# Altium schematic sheet STSPIN32F0A ESC1.SchDoc
size A3
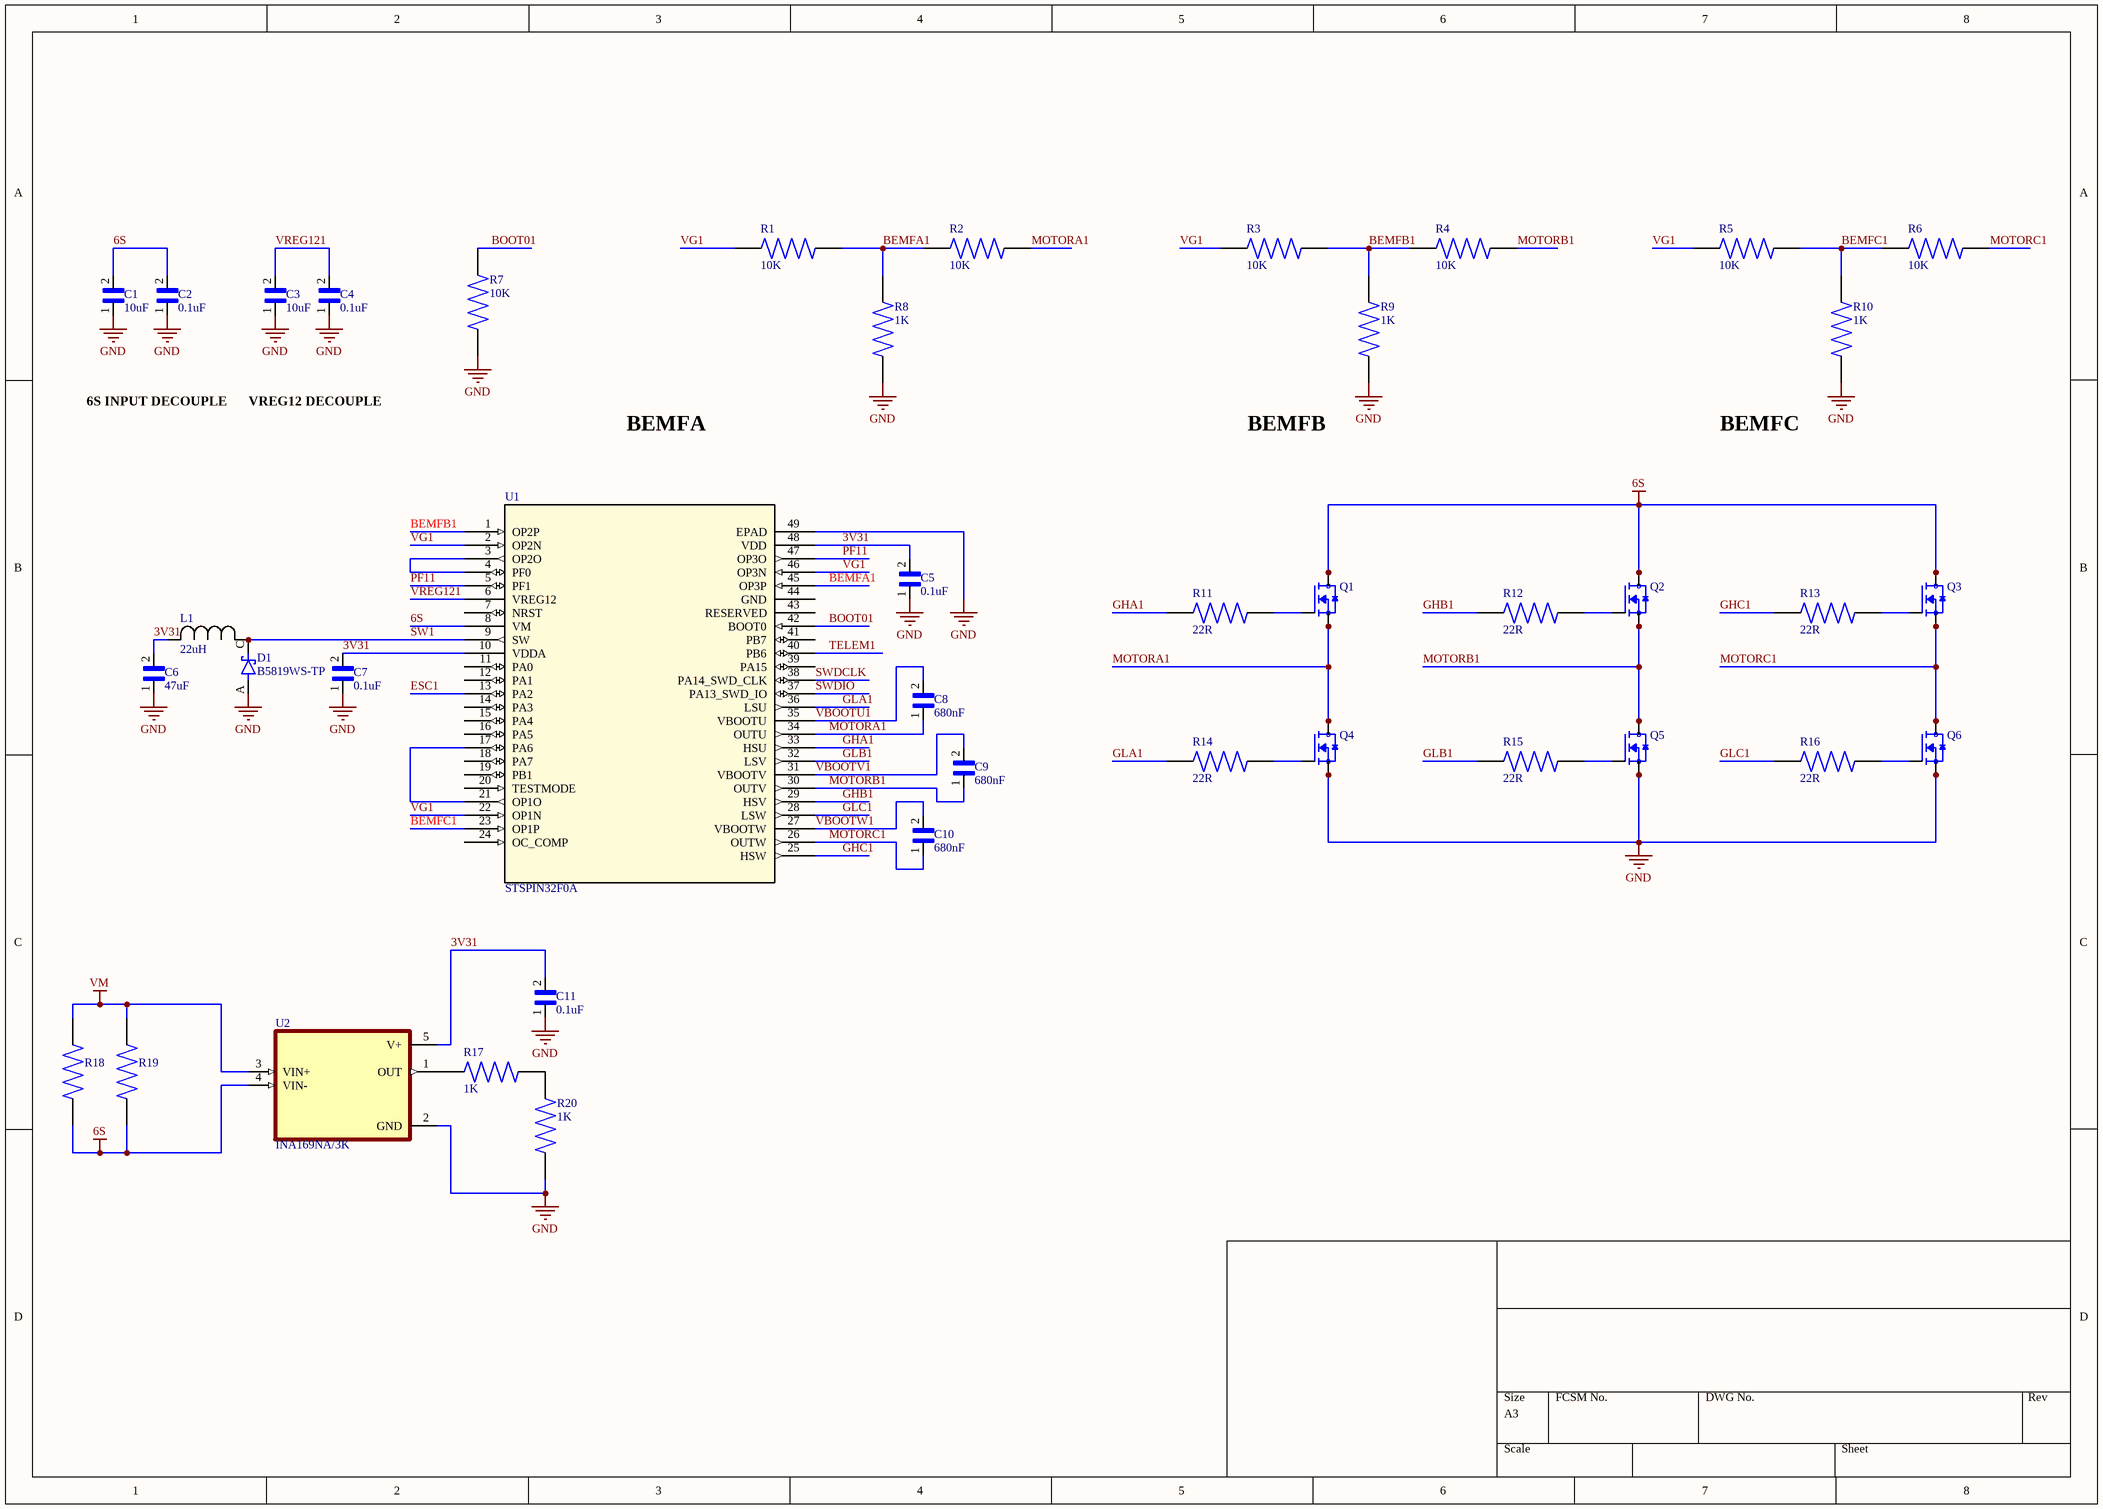
[diagram p0: STSPIN32F0A ESC1.SchDoc]

## Parts
C1  10uF  [CAPC1608X100N]
C2  0.1uF  [CAPC1005X55N]
C3  10uF  [CAPC1608X100N]
C4  0.1uF  [CAPC1005X55N]
C5  0.1uF  [CAPC1005X55N]
C6  47uF  [CAPC1608X90N]
C7  0.1uF  [CAPC1005X55N]
C8  680nF  [CAPC1005X55N]
C9  680nF  [CAPC1005X55N]
C10  680nF  [CAPC1005X55N]
C11  0.1uF  [CAPC1005X55N]
D1  B5819WS-TP  [SOD2512X115N]
L1  22uH  [IND_BOURNS_SRN3015]
Q1  TPHR8504PL,L1Q  [TRANS_TPHR8504PL,L1Q]  (value not drawn)
Q2  TPHR8504PL,L1Q  [TRANS_TPHR8504PL,L1Q]  (value not drawn)
Q3  TPHR8504PL,L1Q  [TRANS_TPHR8504PL,L1Q]  (value not drawn)
Q4  TPHR8504PL,L1Q  [TRANS_TPHR8504PL,L1Q]  (value not drawn)
Q5  TPHR8504PL,L1Q  [TRANS_TPHR8504PL,L1Q]  (value not drawn)
Q6  TPHR8504PL,L1Q  [TRANS_TPHR8504PL,L1Q]  (value not drawn)
R1  10K  [RESC1005X37N]
R2  10K  [RESC1005X37N]
R3  10K  [RESC1005X37N]
R4  10K  [RESC1005X37N]
R5  10K  [RESC1005X37N]
R6  10K  [RESC1005X37N]
R7  10K  [RESC1005X37N]
R8  1K  [RESC1005X37N]
R9  1K  [RESC1005X37N]
R10  1K  [RESC1005X37N]
R11  22R  [RESC1005X37N]
R12  22R  [RESC1005X37N]
R13  22R  [RESC1005X37N]
R14  22R  [RESC1005X37N]
R15  22R  [RESC1005X37N]
R16  22R  [RESC1005X37N]
R17  1K  [RESC1005X37N]
R18  CSSH2512JTL500  [RESC6232X104N]  (value not drawn)
R19  CSSH2512JTL500  [RESC6232X104N]  (value not drawn)
R20  1K  [RESC1005X37N]
U1  STSPIN32F0A  [VFQFPN-48_7x7x1mm_STM-L]
U2  INA169NA/3K  [SOT95P280X145-5N]

## Nets
6S: C1.2 C2.2 Q1.5(D) Q1.6(D) Q1.7(D) Q1.8(D) Q1.9(D) Q2.5(D) Q2.6(D) Q2.7(D) Q2.8(D) Q2.9(D) Q3.5(D) Q3.6(D) Q3.7(D) Q3.8(D) Q3.9(D) R18.2 R19.2 U1.8(VM) U2.4(VIN-)
GND: C1.1 C2.1 C3.1 C4.1 C5.1 C6.1 C7.1 C11.1 D1.A Q4.1(S) Q4.2(S) Q4.3(S) Q5.1(S) Q5.2(S) Q5.3(S) Q6.1(S) Q6.2(S) Q6.3(S) R7.1 R8.2 R9.2 R10.2 R20.2 U1.49(EPAD) U2.2(GND)
VM: R18.1 R19.1 U2.3(VIN+)
3V31: C5.2 C6.2 C7.2 C11.2 L1.2 U1.10(VDDA) U1.48(VDD) U2.5(V+)
BEMFA1: R1.1 R2.2 R8.1 U1.45(OP3P)
BEMFB1: R3.1 R4.2 R9.1 U1.1(OP2P)
BEMFC1: R5.1 R6.2 R10.1 U1.23(OP1P)
BOOT01: R7.2 U1.42(BOOT0)
ESC1: U1.13(PA2)
GHA1: R11.2 U1.33(HSU)
GHB1: R12.2 U1.29(HSV)
GHC1: R13.2 U1.25(HSW)
GLA1: R14.2 U1.36(LSU)
GLB1: R15.2 U1.32(LSV)
GLC1: R16.2 U1.28(LSW)
MOTORA1: C8.1 Q1.1(S) Q1.2(S) Q1.3(S) Q4.5(D) Q4.6(D) Q4.7(D) Q4.8(D) Q4.9(D) R2.1 U1.34(OUTU)
MOTORB1: C9.1 Q2.1(S) Q2.2(S) Q2.3(S) Q5.5(D) Q5.6(D) Q5.7(D) Q5.8(D) Q5.9(D) R4.1 U1.30(OUTV)
MOTORC1: C10.1 Q3.1(S) Q3.2(S) Q3.3(S) Q6.5(D) Q6.6(D) Q6.7(D) Q6.8(D) Q6.9(D) R6.1 U1.26(OUTW)
PF11: U1.5(PF1) U1.47(OP3O)
SW1: D1.C(K) L1.1 U1.9(SW)
SWDCLK: U1.38(PA14_SWD_CLK)
SWDIO: U1.37(PA13_SWD_IO)
TELEM1: U1.40(PB6)
VBOOTU1: C8.2 U1.35(VBOOTU)
VBOOTV1: C9.2 U1.31(VBOOTV)
VBOOTW1: C10.2 U1.27(VBOOTW)
VG1: R1.2 R3.2 R5.2 U1.2(OP2N) U1.22(OP1N) U1.46(OP3N)
VREG121: C3.2 C4.2 U1.6(VREG12)
NetQ1_4: Q1.4(G) R11.1
NetQ2_4: Q2.4(G) R12.1
NetQ3_4: Q3.4(G) R13.1
NetQ4_4: Q4.4(G) R14.1
NetQ5_4: Q5.4(G) R15.1
NetQ6_4: Q6.4(G) R16.1
NetR17_1: R17.1 U2.1(OUT)
NetR17_2: R17.2 R20.1
NetU1_3: U1.3(OP2O) U1.4(PF0)
NetU1_17: U1.17(PA6) U1.21(OP1O)

Not connected (* = marked no-connect by the designer): U1 7(NRST) 11(PA0) 12(PA1) 14(PA3) 15(PA4) 16(PA5) 18(PA7) 19(PB1) 20(TESTMODE) 24(OC_COMP) 39(PA15) 41(PB7) 43(RESERVED) 44(GND)

## Notes on the sheet
- 6S INPUT DECOUPLE
- VREG12 DECOUPLE
- BEMFA
- BEMFB
- BEMFC

## Library data of the parts
C1 C3 = CL10F104ZB8NNNC: Capacitor 0603 0.1uF Y5V; MF: {'manufacturer': u'Samsung'}; Availability: Unavailable; Package: None; MP: CL10F104ZB8NNNC; Value: *; Price: None
C2 C4 C5 C7-C11 = GRM1555C1H222JA01D: Package: None; Price: None; Value: *; MP: GRM1555C1H222JA01D; Availability: Unavailable
C6 = GRM188R71E224JA88D: SMD Capacitor X7R(EIA) with Capacitance: 0.22uF Tol. 5%. Rated Voltage: 25Vdc; Package: None; Price: None; Value: *; MP: GRM188R71E224JA88D; Availability: Unavailable
D1 = B5819WS-TP: MF: {'manufacturer': u'Micro Commercial Components'}; Package: None; MP: B5819WS-TP; Price: None; Availability: Unavailable; Value: *
L1 = SRN3015-220M: No Description Available; Mfr_Name: Bourns Electronics; Type: DEV; Copyright: Copyright (C) 2022 Ultra Librarian. All rights reserved.; Manufacturer_Part_Number: SRN3015-220M; Digi-Key_Part_Number_1: SRN3015-220MCT-ND; Digi-Key_Part_Number_2: SRN3015-220MDKR-ND; Digi-Key_Part_Number_3: SRN3015-220MTR-ND; RefDes: RefDes
Q1-Q6 = TPHR8504PL,L1Q: N-Channel 40V 150A (Tc) 1W (Ta), 170W (Tc) Surface Mount 8-SOP Advance (5x5); MF: Toshiba Semiconductor; Package: SOP-8 Toshiba; Price: None; Value: *; MP: TPHR8504PL,L1Q; SnapEDA_Link: https://www.snapeda.com/parts/TPHR8504PL,L1Q/Toshiba%20Semiconductor%20and%20Storage/view-part/604439/?ref=snap; Availability: Unavailable
R1-R17 R20 = RE0402BRE07330KL: MF: {'manufacturer': u'Yageo'}; Availability: Unavailable; Package: None; MP: RE0402BRE07330KL; Value: *; Price: None
R18 R19 = CSSH2512JTL500: MF: {'manufacturer': u'Stackpole Electronics Inc'}; Price: None; MP: CSSH2512JTL500; Package: None; Value: *; Availability: Unavailable
U1 = STSPIN32F0A: No Description Available; Mfr_Name: STMicroelectronics; Copyright: Copyright (C) 2022 Ultra Librarian. All rights reserved.; Manufacturer_Part_Number: STSPIN32F0A; Digi-Key_Part_Number_1: 497-17635-ND; RefDes: RefDes; Type: DEV
U2 = INA169NA/3K: MF: {'manufacturer': u'Texas Instruments'}; Availability: Unavailable; MP: INA169NA/3K; Value: *; Package: None; Price: None